# EAGLE design MatrixBoard (EAGLE 6.4)
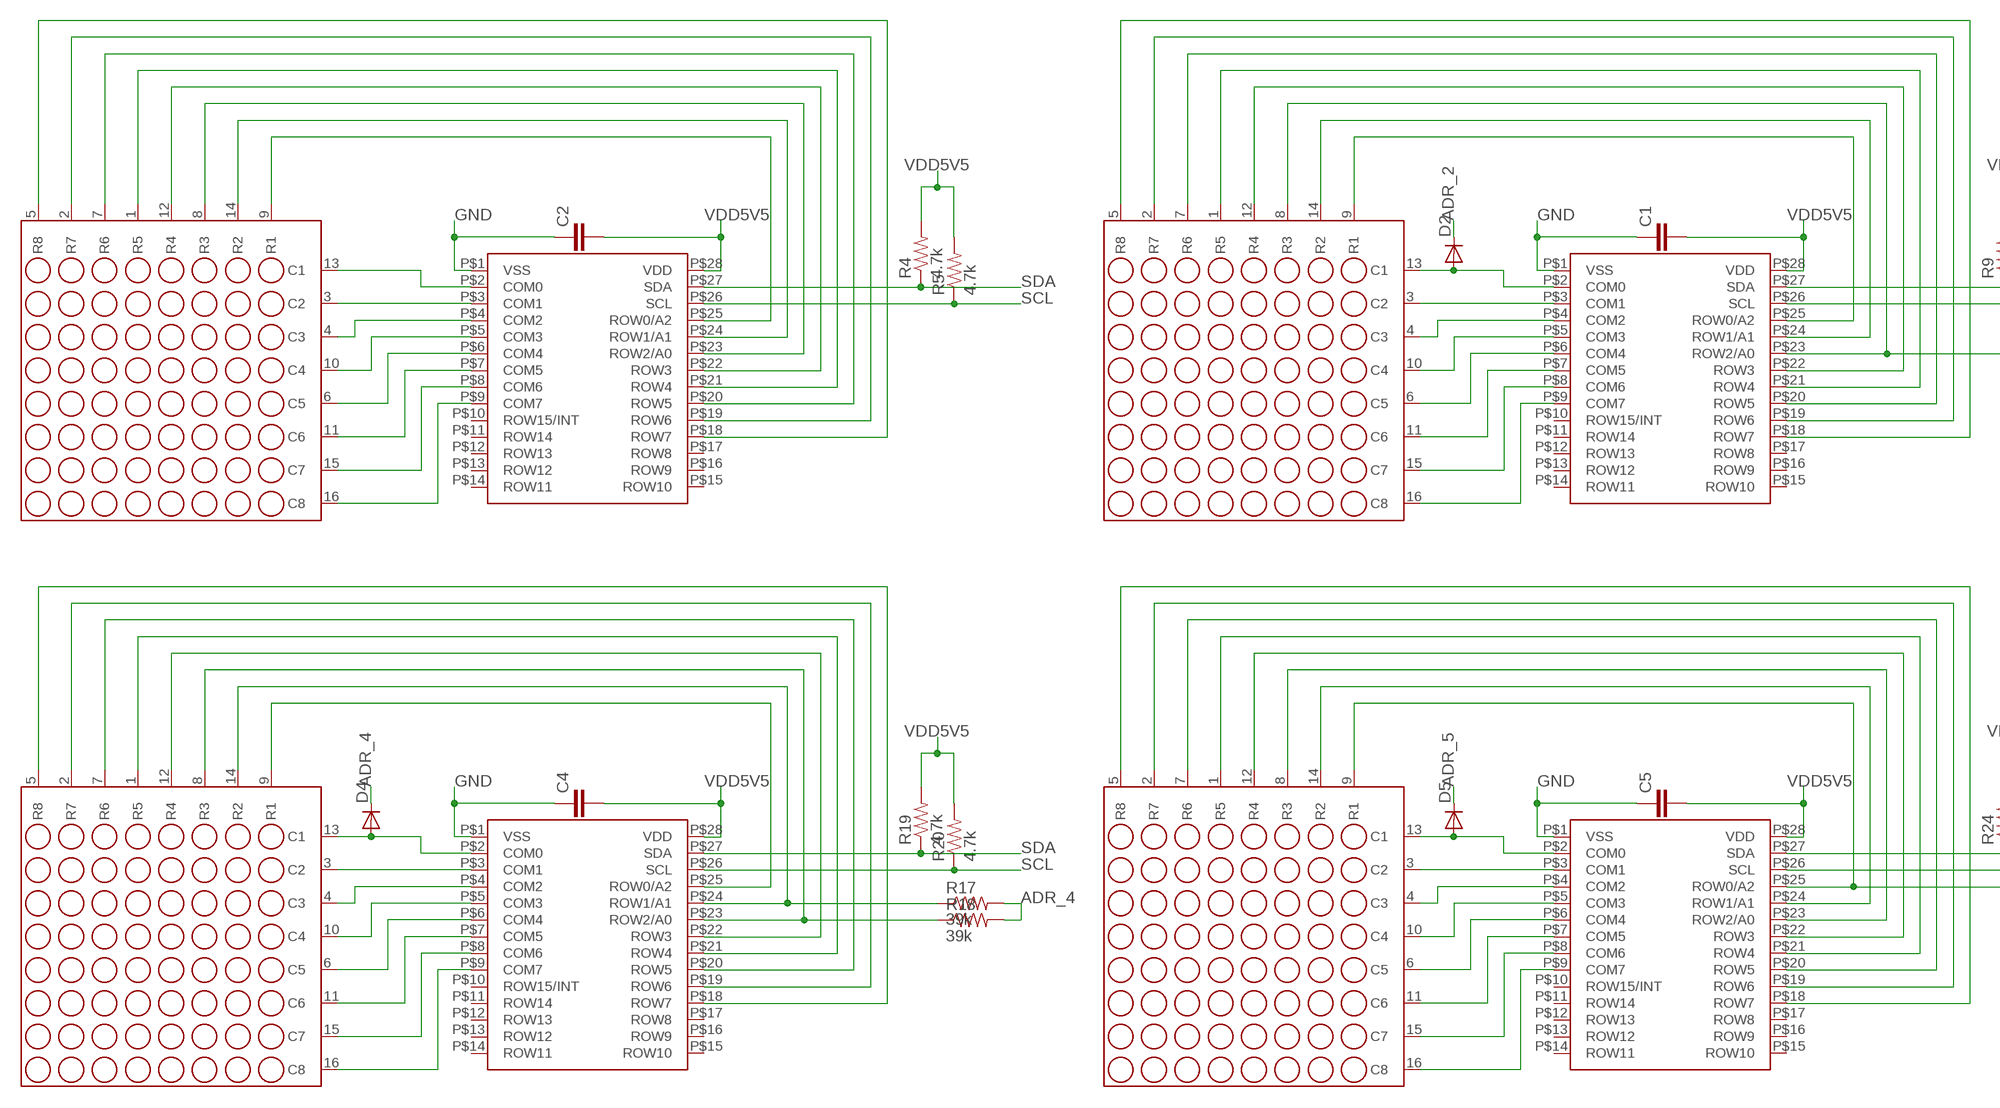
[diagram p0: schematic, sheet 1, part 1 of 2]
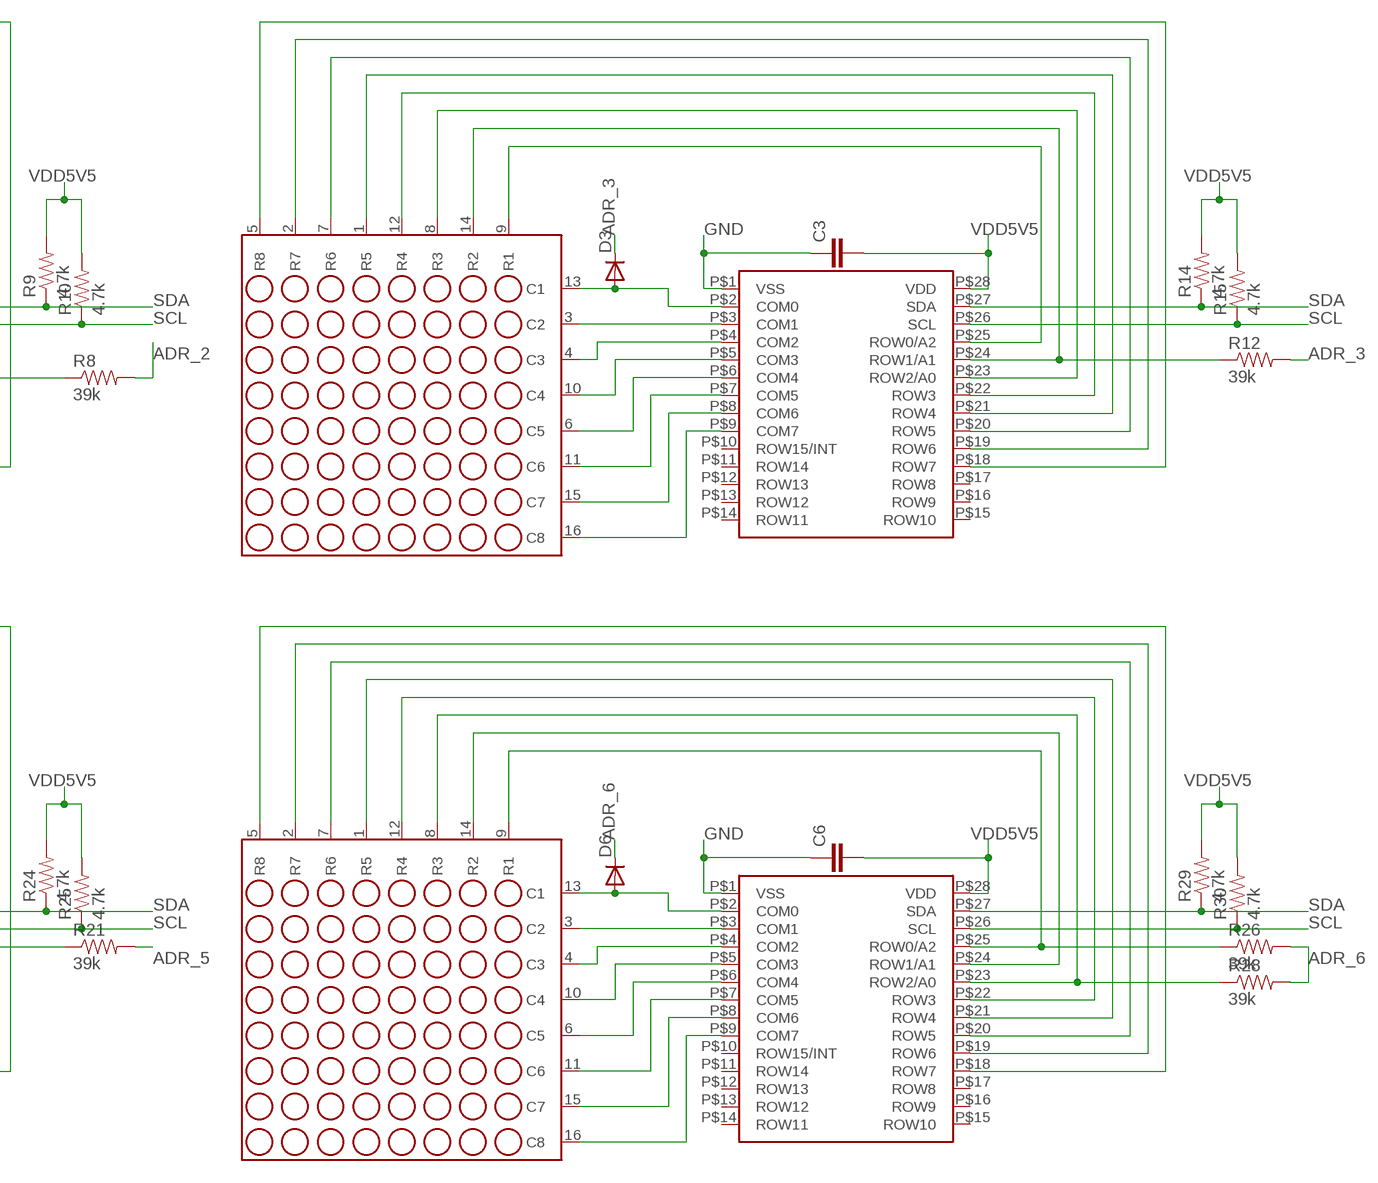
[diagram p1: schematic, sheet 1, part 2 of 2]

## Parts
C1  CAP0805  [0805]
C2  CAP0805  [0805]
C3  CAP0805  [0805]
C4  CAP0805  [0805]
C5  CAP0805  [0805]
C6  CAP0805  [0805]
D2  DIODESMA  [SMA-DIODE]
D3  DIODESMA  [SMA-DIODE]
D4  DIODESMA  [SMA-DIODE]
D5  DIODESMA  [SMA-DIODE]
D6  DIODESMA  [SMA-DIODE]
R4  4.7k  RESISTOR0805-RES  [0805]
R5  4.7k  RESISTOR0805-RES  [0805]
R8  39k  RESISTOR0805-RES  [0805]
R9  4.7k  RESISTOR0805-RES  [0805]
R10  4.7k  RESISTOR0805-RES  [0805]
R12  39k  RESISTOR0805-RES  [0805]
R14  4.7k  RESISTOR0805-RES  [0805]
R15  4.7k  RESISTOR0805-RES  [0805]
R17  39k  RESISTOR0805-RES  [0805]
R18  39k  RESISTOR0805-RES  [0805]
R19  4.7k  RESISTOR0805-RES  [0805]
R20  4.7k  RESISTOR0805-RES  [0805]
R21  39k  RESISTOR0805-RES  [0805]
R24  4.7k  RESISTOR0805-RES  [0805]
R25  4.7k  RESISTOR0805-RES  [0805]
R26  39k  RESISTOR0805-RES  [0805]
R28  39k  RESISTOR0805-RES  [0805]
R29  4.7k  RESISTOR0805-RES  [0805]
R30  4.7k  RESISTOR0805-RES  [0805]
U$2  A-788BS  [A-788BS]
U$3  HT16K33  [SOIC28-W]
U$4  A-788BS  [A-788BS]
U$5  HT16K33  [SOIC28-W]
U$6  A-788BS  [A-788BS]
U$7  HT16K33  [SOIC28-W]
U$8  A-788BS  [A-788BS]
U$9  HT16K33  [SOIC28-W]
U$10  A-788BS  [A-788BS]
U$11  HT16K33  [SOIC28-W]
U$12  A-788BS  [A-788BS]
U$13  HT16K33  [SOIC28-W]

## Nets
ADR_2: D2.C R8.2
ADR_3: D3.C R12.2
ADR_4: D4.C R17.2 R18.2
ADR_5: D5.C R21.2
ADR_6: D6.C R26.2 R28.2
GND: C1.1 C2.1 C3.1 C4.1 C5.1 C6.1 U$3.P$1(VSS) U$5.P$1(VSS) U$7.P$1(VSS) U$9.P$1(VSS) U$11.P$1(VSS) U$13.P$1(VSS)
N$1: U$2.13(C1) U$3.P$2(COM0)
N$2: U$2.3(C2) U$3.P$3(COM1)
N$3: U$2.4(C3) U$3.P$4(COM2)
N$4: U$2.10(C4) U$3.P$5(COM3)
N$5: U$2.6(C5) U$3.P$6(COM4)
N$6: U$2.11(C6) U$3.P$7(COM5)
N$7: U$2.15(C7) U$3.P$8(COM6)
N$8: U$2.16(C8) U$3.P$9(COM7)
N$9: D2.A U$4.13(C1) U$5.P$2(COM0)
N$10: U$4.3(C2) U$5.P$3(COM1)
N$11: U$4.4(C3) U$5.P$4(COM2)
N$12: U$4.10(C4) U$5.P$5(COM3)
N$13: U$2.9(R1) U$3.P$25(ROW0/A2)
N$14: U$2.14(R2) U$3.P$24(ROW1/A1)
N$15: U$2.8(R3) U$3.P$23(ROW2/A0)
N$16: U$2.12(R4) U$3.P$22(ROW3)
N$17: U$2.1(R5) U$3.P$21(ROW4)
N$18: U$2.7(R6) U$3.P$20(ROW5)
N$19: U$2.2(R7) U$3.P$19(ROW6)
N$20: U$2.5(R8) U$3.P$18(ROW7)
N$21: U$4.6(C5) U$5.P$6(COM4)
N$22: U$4.11(C6) U$5.P$7(COM5)
N$23: U$4.15(C7) U$5.P$8(COM6)
N$24: U$4.16(C8) U$5.P$9(COM7)
N$25: U$4.9(R1) U$5.P$25(ROW0/A2)
N$26: U$4.14(R2) U$5.P$24(ROW1/A1)
N$27: R8.1 U$4.8(R3) U$5.P$23(ROW2/A0)
N$28: U$4.12(R4) U$5.P$22(ROW3)
N$29: U$4.1(R5) U$5.P$21(ROW4)
N$30: U$4.7(R6) U$5.P$20(ROW5)
N$31: U$4.2(R7) U$5.P$19(ROW6)
N$32: U$4.5(R8) U$5.P$18(ROW7)
N$33: D3.A U$6.13(C1) U$7.P$2(COM0)
N$34: U$6.3(C2) U$7.P$3(COM1)
N$35: U$6.4(C3) U$7.P$4(COM2)
N$36: U$6.10(C4) U$7.P$5(COM3)
N$37: U$6.6(C5) U$7.P$6(COM4)
N$38: U$6.11(C6) U$7.P$7(COM5)
N$39: U$6.15(C7) U$7.P$8(COM6)
N$40: U$6.16(C8) U$7.P$9(COM7)
N$41: U$6.9(R1) U$7.P$25(ROW0/A2)
N$42: R12.1 U$6.14(R2) U$7.P$24(ROW1/A1)
N$43: U$6.8(R3) U$7.P$23(ROW2/A0)
N$44: U$6.12(R4) U$7.P$22(ROW3)
N$45: U$6.1(R5) U$7.P$21(ROW4)
N$46: U$6.7(R6) U$7.P$20(ROW5)
N$47: U$6.2(R7) U$7.P$19(ROW6)
N$48: U$6.5(R8) U$7.P$18(ROW7)
N$49: D4.A U$12.13(C1) U$13.P$2(COM0)
N$50: U$12.3(C2) U$13.P$3(COM1)
N$51: U$12.4(C3) U$13.P$4(COM2)
N$52: U$12.10(C4) U$13.P$5(COM3)
N$53: U$12.6(C5) U$13.P$6(COM4)
N$54: U$12.11(C6) U$13.P$7(COM5)
N$55: U$12.15(C7) U$13.P$8(COM6)
N$56: U$12.16(C8) U$13.P$9(COM7)
N$57: U$12.9(R1) U$13.P$25(ROW0/A2)
N$58: R17.1 U$12.14(R2) U$13.P$24(ROW1/A1)
N$59: R18.1 U$12.8(R3) U$13.P$23(ROW2/A0)
N$60: U$12.12(R4) U$13.P$22(ROW3)
N$61: U$12.1(R5) U$13.P$21(ROW4)
N$62: U$12.7(R6) U$13.P$20(ROW5)
N$63: U$12.2(R7) U$13.P$19(ROW6)
N$64: U$12.5(R8) U$13.P$18(ROW7)
N$65: D5.A U$10.13(C1) U$11.P$2(COM0)
N$66: U$10.3(C2) U$11.P$3(COM1)
N$67: U$10.4(C3) U$11.P$4(COM2)
N$68: U$10.10(C4) U$11.P$5(COM3)
N$69: U$10.6(C5) U$11.P$6(COM4)
N$70: U$10.11(C6) U$11.P$7(COM5)
N$71: U$10.15(C7) U$11.P$8(COM6)
N$72: U$10.16(C8) U$11.P$9(COM7)
N$73: R21.1 U$10.9(R1) U$11.P$25(ROW0/A2)
N$74: U$10.14(R2) U$11.P$24(ROW1/A1)
N$75: U$10.8(R3) U$11.P$23(ROW2/A0)
N$76: U$10.12(R4) U$11.P$22(ROW3)
N$77: U$10.1(R5) U$11.P$21(ROW4)
N$78: U$10.7(R6) U$11.P$20(ROW5)
N$79: U$10.2(R7) U$11.P$19(ROW6)
N$80: U$10.5(R8) U$11.P$18(ROW7)
N$81: D6.A U$8.13(C1) U$9.P$2(COM0)
N$82: U$8.3(C2) U$9.P$3(COM1)
N$83: U$8.4(C3) U$9.P$4(COM2)
N$84: U$8.10(C4) U$9.P$5(COM3)
N$85: U$8.6(C5) U$9.P$6(COM4)
N$86: U$8.11(C6) U$9.P$7(COM5)
N$87: U$8.15(C7) U$9.P$8(COM6)
N$88: U$8.16(C8) U$9.P$9(COM7)
N$89: R26.1 U$8.9(R1) U$9.P$25(ROW0/A2)
N$90: U$8.14(R2) U$9.P$24(ROW1/A1)
N$91: R28.1 U$8.8(R3) U$9.P$23(ROW2/A0)
N$92: U$8.12(R4) U$9.P$22(ROW3)
N$93: U$8.1(R5) U$9.P$21(ROW4)
N$94: U$8.7(R6) U$9.P$20(ROW5)
N$95: U$8.2(R7) U$9.P$19(ROW6)
N$96: U$8.5(R8) U$9.P$18(ROW7)
SCL: R5.1 R10.1 R15.1 R20.1 R25.1 R30.1 U$3.P$26(SCL) U$5.P$26(SCL) U$7.P$26(SCL) U$9.P$26(SCL) U$11.P$26(SCL) U$13.P$26(SCL)
SDA: R4.1 R9.1 R14.1 R19.1 R24.1 R29.1 U$3.P$27(SDA) U$5.P$27(SDA) U$7.P$27(SDA) U$9.P$27(SDA) U$11.P$27(SDA) U$13.P$27(SDA)
VDD5V5: C1.2 C2.2 C3.2 C4.2 C5.2 C6.2 R4.2 R5.2 R9.2 R10.2 R14.2 R15.2 R19.2 R20.2 R24.2 R25.2 R29.2 R30.2 U$3.P$28(VDD) U$5.P$28(VDD) U$7.P$28(VDD) U$9.P$28(VDD) U$11.P$28(VDD) U$13.P$28(VDD)
Unconnected: U$3.P$10(ROW15/INT) U$3.P$11(ROW14) U$3.P$12(ROW13) U$3.P$13(ROW12) U$3.P$14(ROW11) U$3.P$15(ROW10) U$3.P$16(ROW9) U$3.P$17(ROW8) U$5.P$10(ROW15/INT) U$5.P$11(ROW14) U$5.P$12(ROW13) U$5.P$13(ROW12) U$5.P$14(ROW11) U$5.P$15(ROW10) U$5.P$16(ROW9) U$5.P$17(ROW8) U$7.P$10(ROW15/INT) U$7.P$11(ROW14) U$7.P$12(ROW13) U$7.P$13(ROW12) U$7.P$14(ROW11) U$7.P$15(ROW10) U$7.P$16(ROW9) U$7.P$17(ROW8) U$9.P$10(ROW15/INT) U$9.P$11(ROW14) U$9.P$12(ROW13) U$9.P$13(ROW12) U$9.P$14(ROW11) U$9.P$15(ROW10) U$9.P$16(ROW9) U$9.P$17(ROW8) U$11.P$10(ROW15/INT) U$11.P$11(ROW14) U$11.P$12(ROW13) U$11.P$13(ROW12) U$11.P$14(ROW11) U$11.P$15(ROW10) U$11.P$16(ROW9) U$11.P$17(ROW8) U$13.P$10(ROW15/INT) U$13.P$11(ROW14) U$13.P$12(ROW13) U$13.P$13(ROW12) U$13.P$14(ROW11) U$13.P$15(ROW10) U$13.P$16(ROW9) U$13.P$17(ROW8)

## Library data of the parts
C1-C6 = ASL:CAP: Capacitor Standard 0603 ceramic capacitor, and 0.1" leaded capacitor.
D2-D6 = ASL:DIODE: Diode These are standard reverse protection diodes and small signal diodes. SMA package can handle up to about 1A. SOD-323 can handle about 200mA. What the SOD-323 package when ordering, there are some mfgs out there that are 5-pin packages.
R4 R5 R8-R10 R12 R14 R15 R17-R21 R24-R26 R28-R30 = ASL:RESISTOR: Resistor Basic schematic elements and footprints for 0603, 1206, and PTH resistors.
U$2 U$4 U$6 U$8 U$10 U$12 = pavlo:A-788BS
U$3 U$5 U$7 U$9 U$11 U$13 = pavlo:HT16K33

## Board
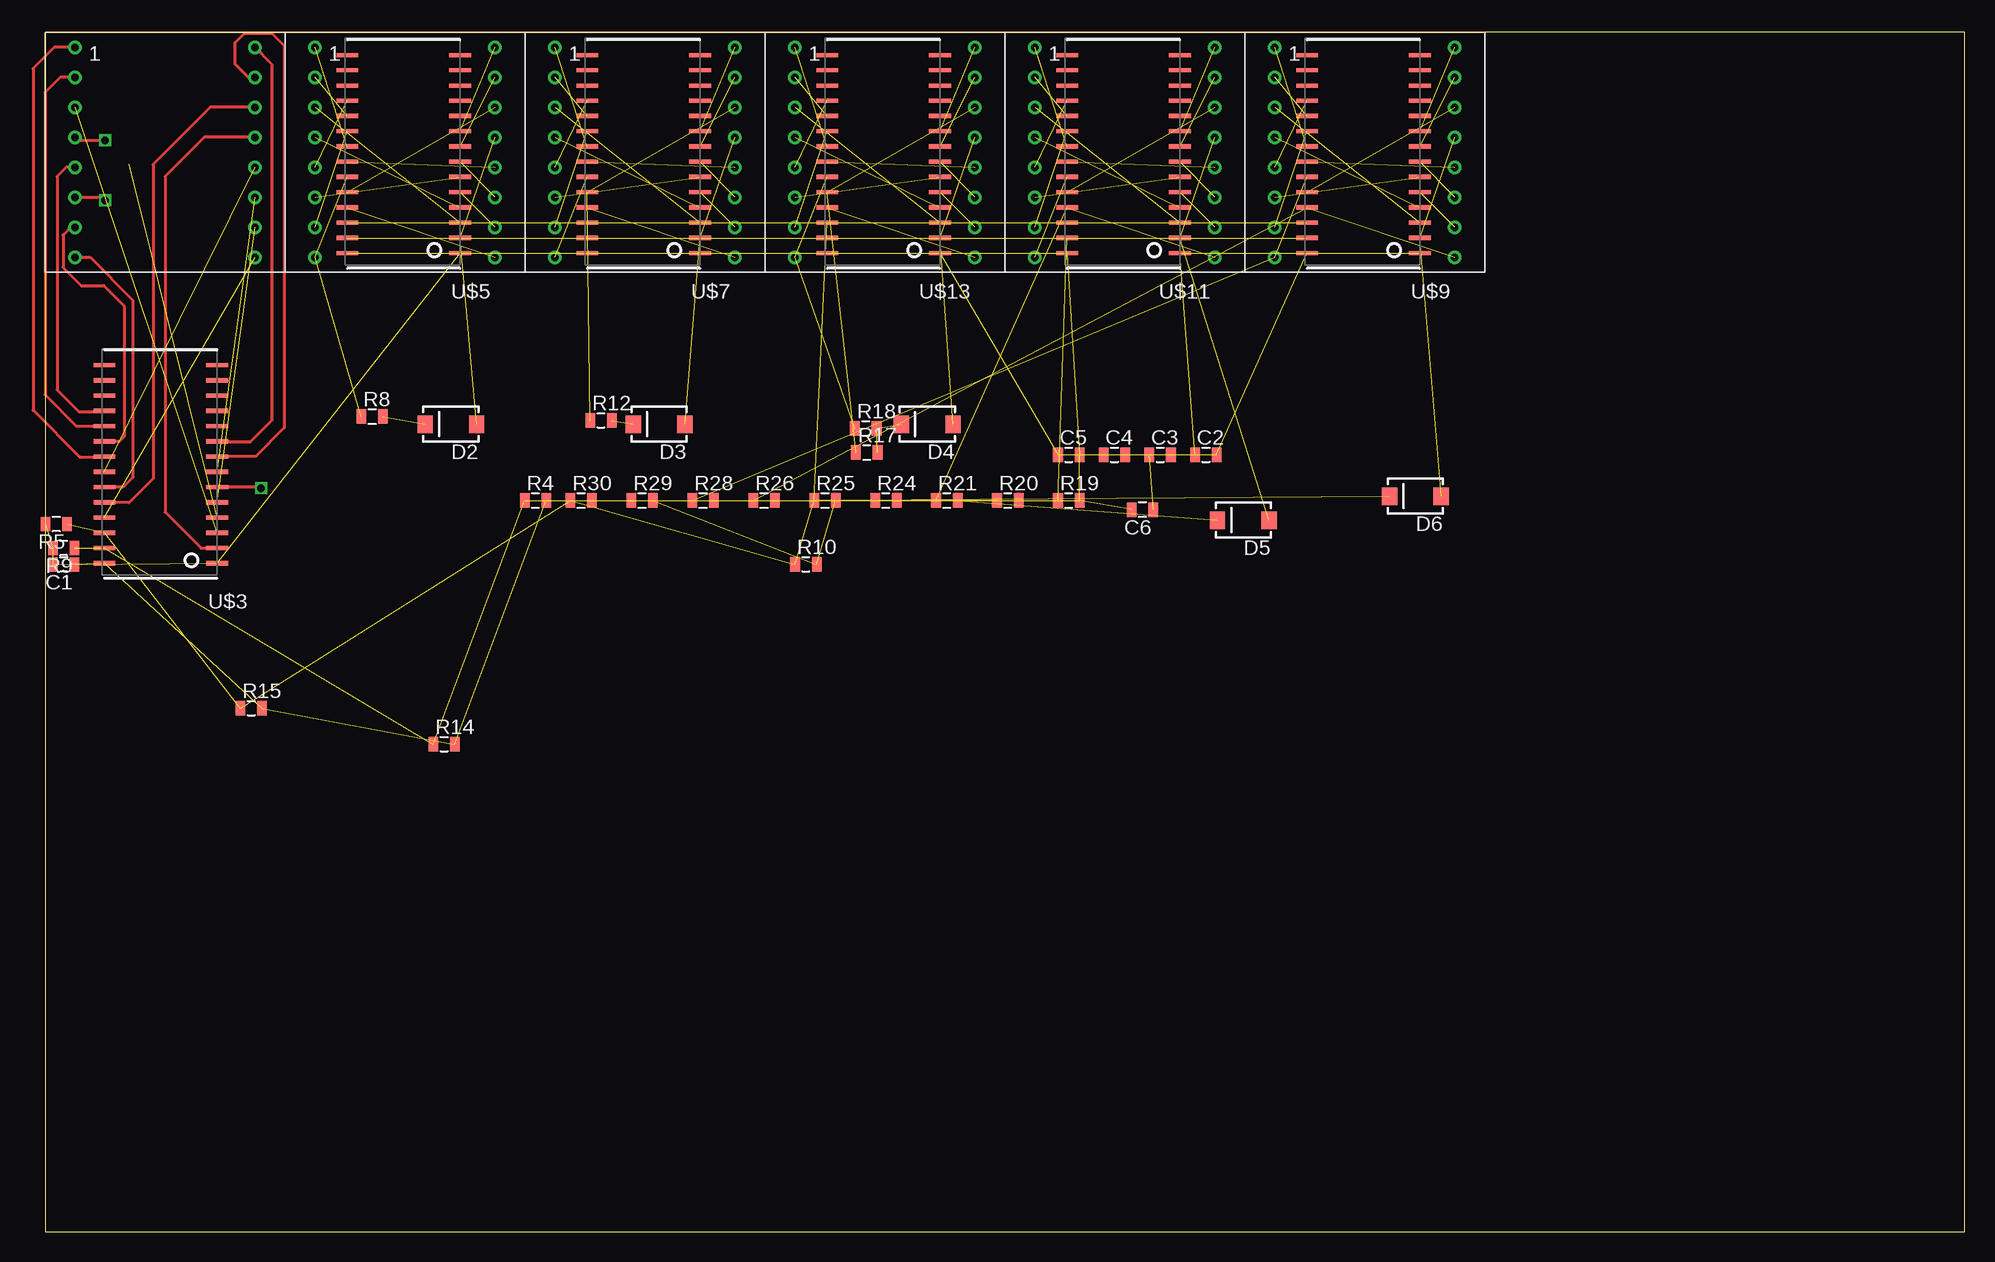
[diagram p2: board, top side]
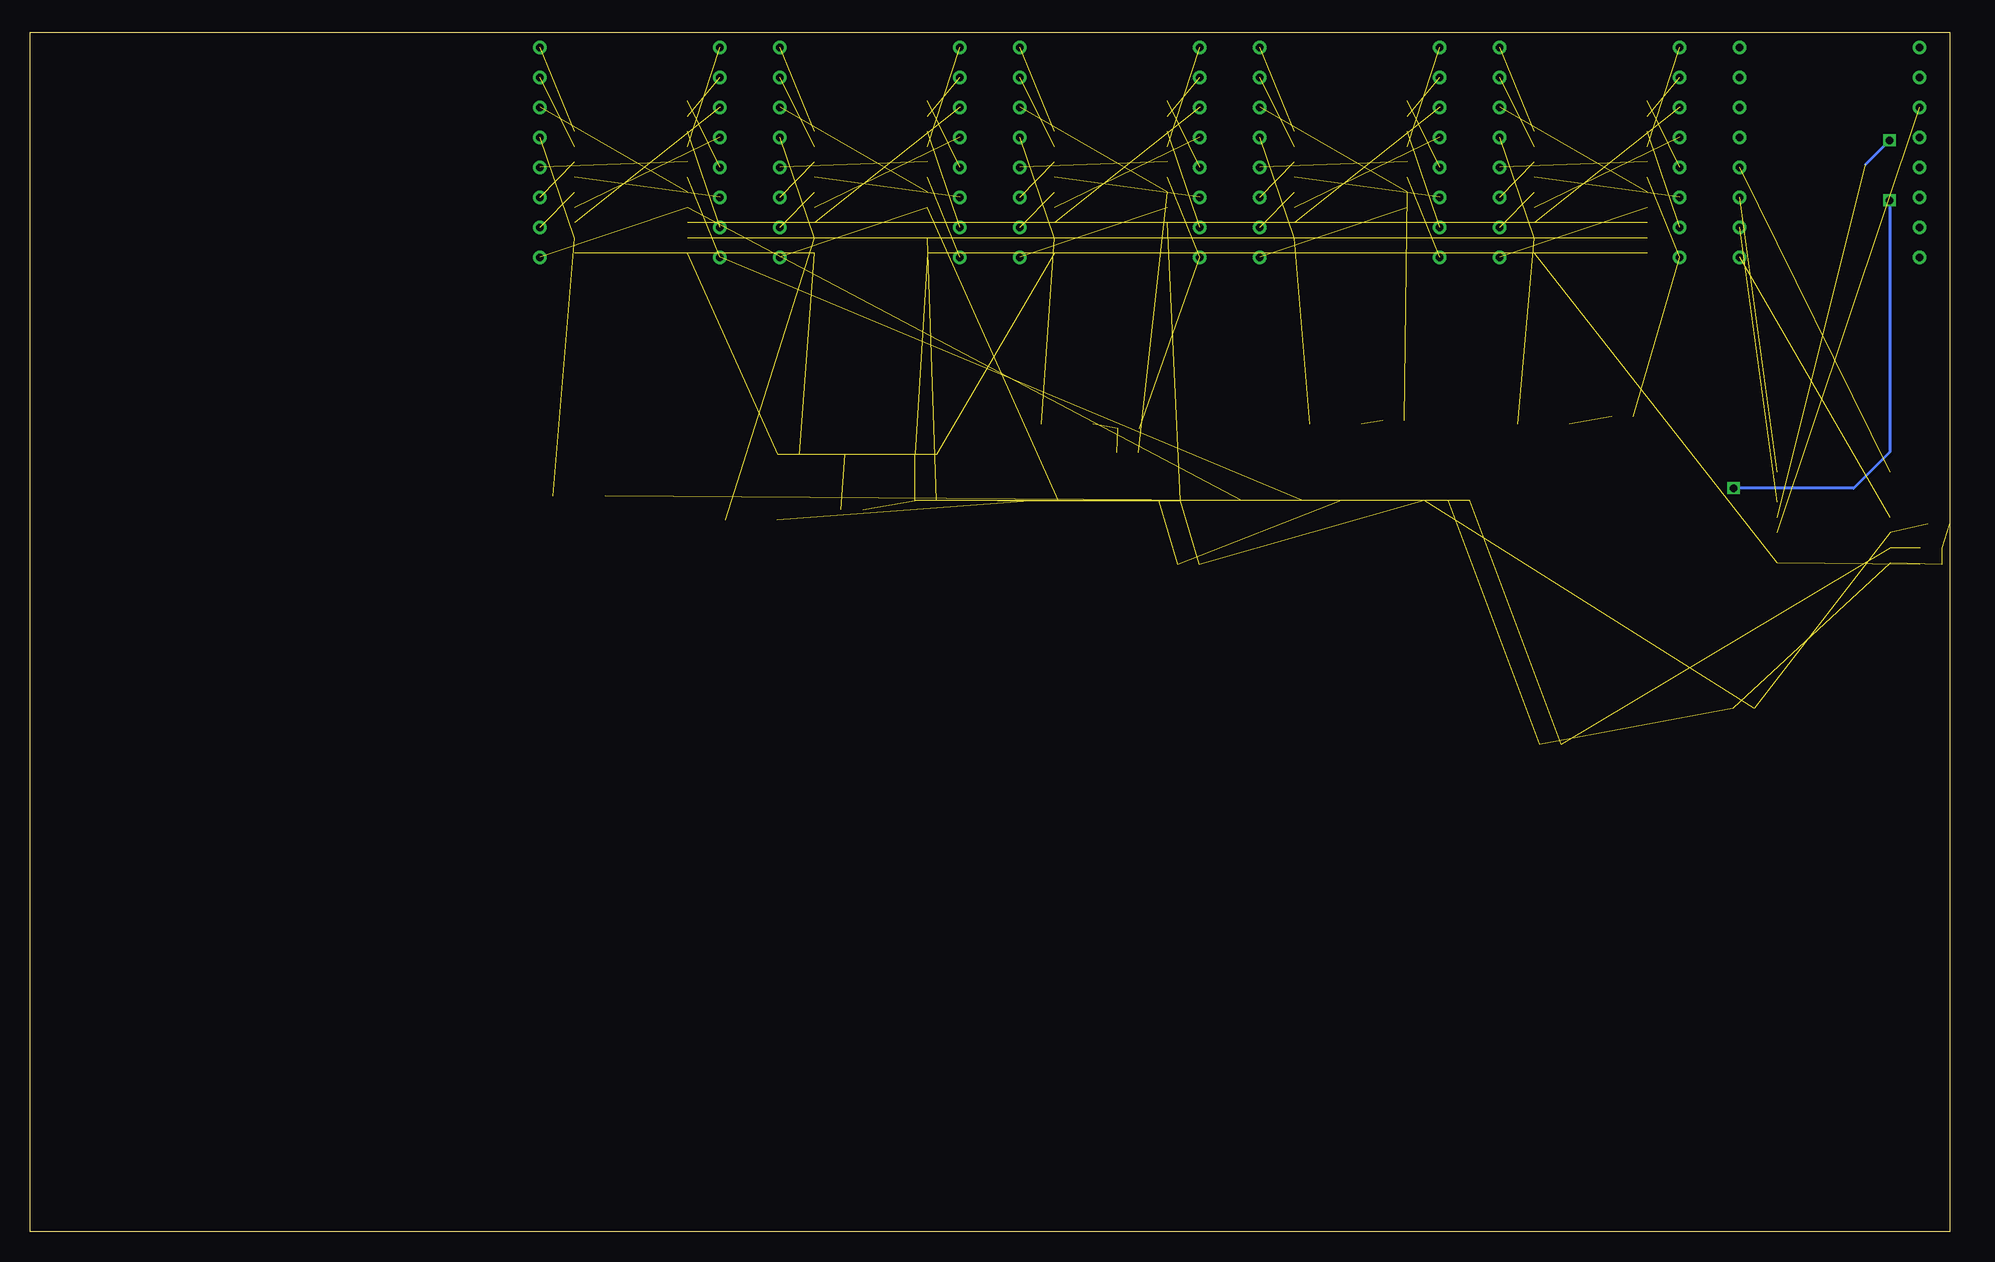
[diagram p3: board, bottom side, seen from below]

Size 160 x 100 mm. Coordinates in mm from the lower left corner, seen from the top.
Outline: 0,0 160,0 160,100 0,100 0,0
Copper layers (1*16): Top 0.035mm / dielectric 1.5mm / Bottom 0.035mm
Design rules "default": minimum track width 10mil, minimum drill 24mil, track to track 8mil, track to pad 8mil, pad to pad 8mil, via to via 8mil, smd to smd 8mil, copper to edge 40mil, drill to drill 8mil, minimum pad ring 10mil, minimum via ring 8mil, stop-mask expansion 4mil, vias tented up to drill 0mil, thermal gap 10mil

### Footprints (pad centres in the part's own frame; a part is rotated, then mirrored left to right if it is on the bottom)
0805 = smd 0.8 x 1.2: 1 -0.9,0; 2 0.9,0
SMA-DIODE = smd 1.27 x 1.47: A -2.15,0; C 2.15,0
A-788BS = drill 0.6: 1 -7.5,8.75; 2 -7.5,6.25; 3 -7.5,3.75; 4 -7.5,1.25; 5 -7.5,-1.25; 6 -7.5,-3.75; 7 -7.5,-6.25; 8 -7.5,-8.75; 9 7.5,-8.75; 10 7.5,-6.25; 11 7.5,-3.75; 12 7.5,-1.25; 13 7.5,1.25; 14 7.5,3.75; 15 7.5,6.25; 16 7.5,8.75
SOIC28-W = smd 1.8 x 0.35: P$1 -4.6,8.4; P$2 -4.6,7.13; P$3 -4.6,5.86; P$4 -4.6,4.59; P$5 -4.6,3.32; P$6 -4.6,2.05; P$7 -4.6,0.78; P$8 -4.6,-0.49; P$9 -4.6,-1.76; P$10 -4.6,-3.03; P$11 -4.6,-4.3; P$12 -4.6,-5.57; P$13 -4.6,-6.84; P$14 -4.6,-8.11; P$15 4.8,-8.11; P$16 4.8,-6.84; P$17 4.8,-5.57; P$18 4.8,-4.3; P$19 4.8,-3.03; P$20 4.8,-1.76; P$21 4.8,-0.49; P$22 4.8,0.78; P$23 4.8,2.05; P$24 4.8,3.32; P$25 4.8,4.59; P$26 4.8,5.86; P$27 4.8,7.13; P$28 4.8,8.4

### Placement (x,y rotation side)
C1  1.56,55.64 180 top
C2  96.76,64.79 0 top
C3  92.95,64.79 0 top
C4  89.14,64.79 0 top
C5  85.33,64.79 0 top
C6  91.48,60.21 180 top
D2  33.83,67.34 180 top
D3  51.18,67.34 180 top
D4  73.53,67.34 180 top
D5  99.88,59.34 180 top
D6  114.23,61.34 180 top
R4  40.88,60.98 0 top
R5  0.93,59.02 180 top
R8  27.26,67.98 0 top
R9  1.55,57.02 180 top
R10  63.42,55.66 0 top
R12  46.34,67.66 0 top
R14  33.26,40.66 0 top
R15  17.18,43.66 0 top
R17  68.49,64.98 0 top
R18  68.41,66.98 0 top
R19  85.33,60.98 0 top
R20  80.25,60.98 0 top
R21  75.17,60.98 0 top
R24  70.09,60.98 0 top
R25  65.01,60.98 0 top
R26  59.93,60.98 0 top
R28  54.85,60.98 0 top
R29  49.77,60.98 0 top
R30  44.69,60.98 0 top
U$2  10,90 0 top
U$3  9.75,64.15 180 top
U$4  30,90 0 top
U$5  30,90 180 top
U$6  50,90 0 top
U$7  50,90 180 top
U$8  110,90 0 top
U$9  110,90 180 top
U$10  90,90 0 top
U$11  90,90 180 top
U$12  70,90 0 top
U$13  70,90 180 top

### Tracks (layer width: path | path; a pad name or v marks a point on that pad's centre or on a via)
ADR_2  (1 unrouted)
ADR_3  (1 unrouted)
ADR_4  (2 unrouted)
ADR_5  (1 unrouted)
ADR_6  (2 unrouted)
GND  (11 unrouted)
N$1
  Top 0.254: U$2.13 13.25,91.25 10,88 10,60 13,57 14.33,57 U$3.P$2
N$2  (1 unrouted)
N$3  (via drill 0.6)  (1 unrouted)
  Top 0.254: U$2.4 2.75,91 v5,91
  Bottom 0.254: v5,91 7,89
N$4  (1 unrouted)
N$5  (via drill 0.6)
  Top 0.254: U$2.6 4.75,86.25 v5,86 | v18,62 17.9,62.1 U$3.P$6
  Bottom 0.254: v5,86 5,65 8,62 v18,62
N$6  (1 unrouted)
N$7
  Top 0.254: U$2.15 16.95,96.25 15.85,97.35 15.85,99.15 16.65,99.95 18.9,99.95 19.95,98.9 19.95,67.05 17.55,64.65 U$3.P$8
N$8
  Top 0.254: U$3.P$9 17.16,65.91 18.95,67.7 18.95,97.3 U$2.16
N$9  (2 unrouted)
N$10  (1 unrouted)
N$11  (1 unrouted)
N$12  (1 unrouted)
N$13  (1 unrouted)
N$14
  Top 0.254: U$2.14 13.75,93.75 9,89 9,62.8 7,60.8 4.98,60.8 U$3.P$24
N$15
  Top 0.254: U$2.8 3.75,81.25 7.3,77.7 7.3,62.9 6.5,62.1 U$3.P$23
N$16  (1 unrouted)
N$17
  Top 0.254: U$2.1 0.75,98.75 -1,97 -1,68.5 2.9,64.6 4.91,64.6 U$3.P$21
N$18
  Top 0.254: U$2.7 2.15,83.75 1.5,83.1 1.5,80.4 3,78.9 4.9,78.9 6.6,77.2 6.6,66.3 6.2,65.9 U$3.P$20
N$19
  Top 0.254: U$2.2 1.25,96.25 0,95 0,69.8 2.6,67.2 4.93,67.2 U$3.P$19
N$20
  Top 0.254: U$2.5 1.75,88.75 1,88 1,70.2 2.8,68.4 4.9,68.4 U$3.P$18
N$21  (1 unrouted)
N$22  (1 unrouted)
N$23  (1 unrouted)
N$24  (1 unrouted)
N$25  (1 unrouted)
N$26  (1 unrouted)
N$27  (2 unrouted)
N$28  (1 unrouted)
N$29  (1 unrouted)
N$30  (1 unrouted)
N$31  (1 unrouted)
N$32  (1 unrouted)
N$33  (2 unrouted)
N$34  (1 unrouted)
N$35  (1 unrouted)
N$36  (1 unrouted)
N$37  (1 unrouted)
N$38  (1 unrouted)
N$39  (1 unrouted)
N$40  (1 unrouted)
N$41  (1 unrouted)
N$42  (2 unrouted)
N$43  (1 unrouted)
N$44  (1 unrouted)
N$45  (1 unrouted)
N$46  (1 unrouted)
N$47  (1 unrouted)
N$48  (1 unrouted)
N$49  (2 unrouted)
N$50  (1 unrouted)
N$51  (1 unrouted)
N$52  (1 unrouted)
N$53  (1 unrouted)
N$54  (1 unrouted)
N$55  (1 unrouted)
N$56  (1 unrouted)
N$57  (1 unrouted)
N$58  (2 unrouted)
N$59  (2 unrouted)
N$60  (1 unrouted)
N$61  (1 unrouted)
N$62  (1 unrouted)
N$63  (1 unrouted)
N$64  (1 unrouted)
N$65  (2 unrouted)
N$66  (1 unrouted)
N$67  (1 unrouted)
N$68  (1 unrouted)
N$69  (1 unrouted)
N$70  (1 unrouted)
N$71  (1 unrouted)
N$72  (1 unrouted)
N$73  (2 unrouted)
N$74  (1 unrouted)
N$75  (1 unrouted)
N$76  (1 unrouted)
N$77  (1 unrouted)
N$78  (1 unrouted)
N$79  (1 unrouted)
N$80  (1 unrouted)
N$81  (2 unrouted)
N$82  (1 unrouted)
N$83  (1 unrouted)
N$84  (1 unrouted)
N$85  (1 unrouted)
N$86  (1 unrouted)
N$87  (1 unrouted)
N$88  (1 unrouted)
N$89  (2 unrouted)
N$90  (1 unrouted)
N$91  (2 unrouted)
N$92  (1 unrouted)
N$93  (1 unrouted)
N$94  (1 unrouted)
N$95  (1 unrouted)
N$96  (1 unrouted)
SCL  (11 unrouted)
SDA  (11 unrouted)
VDD5V5  (23 unrouted)